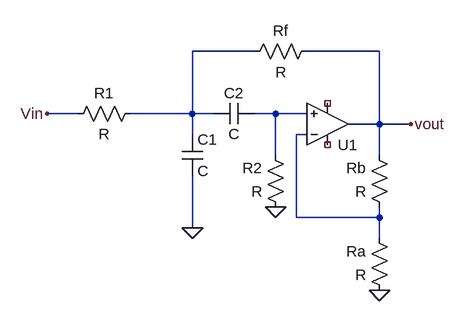
[diagram p0: schematic Draft1.asc]
Draft1.asc, the LTspice schematic file:
Version 4
SHEET 1 880 680
WIRE 400 -64 304 -64
WIRE 592 -64 480 -64
WIRE 128 32 80 32
WIRE 304 32 304 -64
WIRE 304 32 208 32
WIRE 336 32 304 32
WIRE 432 32 400 32
WIRE 480 32 432 32
WIRE 592 48 592 -64
WIRE 592 48 544 48
WIRE 640 48 592 48
WIRE 304 64 304 32
WIRE 480 64 464 64
WIRE 432 96 432 32
WIRE 592 96 592 48
WIRE 464 192 464 64
WIRE 592 192 592 176
WIRE 592 192 464 192
WIRE 304 208 304 128
WIRE 592 224 592 192
FLAG 304 208 0
FLAG 432 176 0
FLAG 592 304 0
FLAG 640 48 vout
FLAG 80 32 Vin
SYMBOL res 224 16 R90
WINDOW 0 0 56 VBottom 2
WINDOW 3 32 56 VTop 2
SYMATTR InstName R1
SYMBOL res 496 -80 R90
WINDOW 0 0 56 VBottom 2
WINDOW 3 32 56 VTop 2
SYMATTR InstName Rf
SYMBOL res 448 192 R180
WINDOW 0 36 76 Left 2
WINDOW 3 36 40 Left 2
SYMATTR InstName R2
SYMBOL res 608 192 R180
WINDOW 0 36 76 Left 2
WINDOW 3 36 40 Left 2
SYMATTR InstName Rb
SYMBOL res 608 320 R180
WINDOW 0 36 76 Left 2
WINDOW 3 36 40 Left 2
SYMATTR InstName Ra
SYMBOL cap 400 16 R90
WINDOW 0 0 32 VBottom 2
WINDOW 3 32 32 VTop 2
SYMATTR InstName C2
SYMBOL OpAmps\\UniversalOpAmp2 512 48 M180
SYMATTR InstName U1
SYMBOL cap 288 64 R0
SYMATTR InstName C1

The netlist it stands for:
* Draft1.asc
R1 N001 Vin R
Rf vout N001 R
R2 0 N002 R
Rb N003 vout R
Ra 0 N003 R
C2 N002 N001 C
XU1 N002 N003 NC_01 NC_02 vout level2 Avol=1Meg GBW=10Meg Slew=10Meg Ilimit=25m Rail=0 Vos=0 En=0 Enk=0 In=0 Ink=0 Rin=500Meg  ; pins In+ In- V+ V- OUT
C1 N001 0 C
.lib UniversalOpAmp2.lib
.backanno
.end